# Altium schematic sheet LGT8F328P_48PIN最小系统.SchDoc
size A3
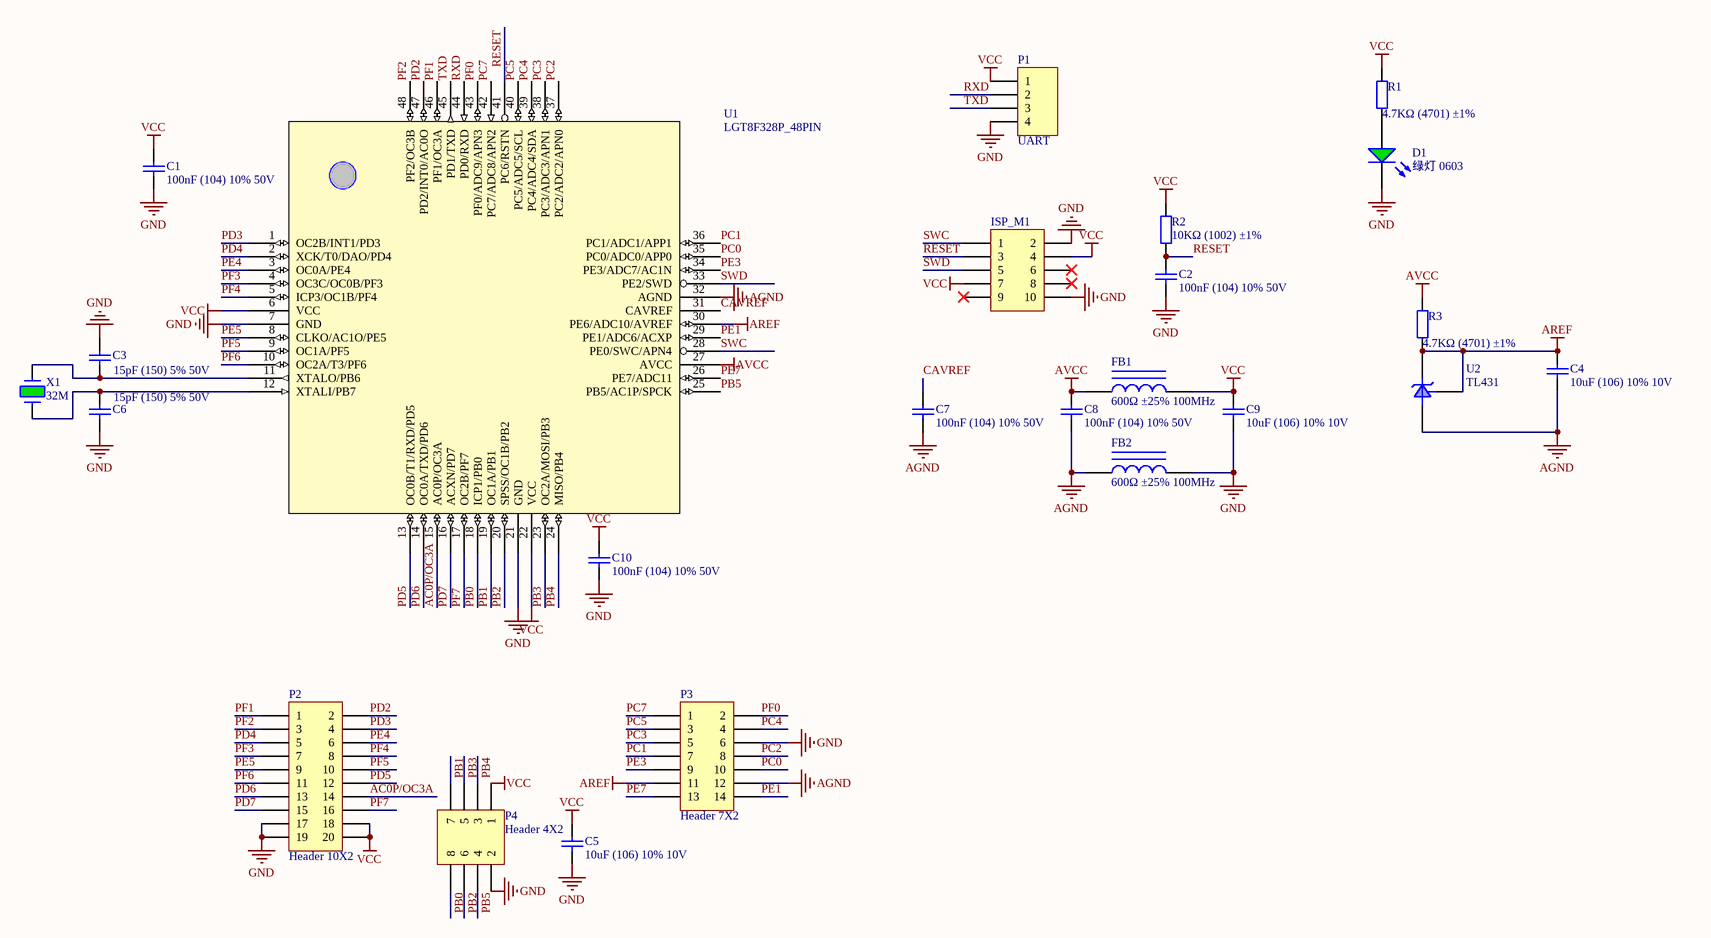
[diagram p0: LGT8F328P_48PIN最小系统.SchDoc]

## Parts
C1  100nF (104) 10% 50V  [LC-0603_C]
C2  100nF (104) 10% 50V  [LC-0603_C]
C3  15pF (150) 5% 50V  [0603_C]
C4  10uF (106) 10% 10V  [LC-0603_C]
C5  10uF (106) 10% 10V  [LC-0603_C]
C6  15pF (150) 5% 50V  [0603_C]
C7  100nF (104) 10% 50V  [LC-0603_C]
C8  100nF (104) 10% 50V  [LC-0603_C]
C9  10uF (106) 10% 10V  [LC-0603_C]
C10  100nF (104) 10% 50V  [LC-0603_C]
D1  绿灯 0603  [0603_LED_S1]
FB1  600Ω ±25% 100MHz  [0805_L]
FB2  600Ω ±25% 100MHz  [0805_L]
ISP_M1  ISP2*5  [IDC2x5]  (value not drawn)
P1  UART  [HDR1X4]
P2  Header 10X2  [HDR2X10]
P3  Header 7X2  [HDR2X7]
P4  Header 4X2  [HDR2X4]
R1  4.7KΩ (4701) ±1%  [LC-0603_R]
R2  10KΩ (1002) ±1%  [LC-0603_R]
R3  4.7KΩ (4701) ±1%  [LC-0603_R]
U1  LGT8F328P_48PIN  [LC-LQFP-48_7x7x05P]
U2  TL431  [LC-SOT-23(SOT-23-3)]
X1  32M  [49/S_N]

## Nets
AGND: C4.1 C7.1 C8.1 FB2.1 P3.12 U1.32(AGND) U2.3(A)
AREF: C4.2 P3.11 R3.1 U1.30(PE6/ADC10/AVREF) U2.1(R) U2.2(K)
AVCC: C8.2 FB1.1 R3.2 U1.27(AVCC)
GND: C1.2 C2.1 C3.2 C5.1 C6.1 C9.1 C10.2 D1.K FB2.2 ISP_M1.2 ISP_M1.10 P1.4 P2.17 P2.19 P3.6 P4.2 U1.7(GND) U1.21(GND)
VCC: C1.1 C5.2 C9.2 C10.1 FB1.2 ISP_M1.4 ISP_M1.7 P1.1 P2.18 P2.20 P4.1 R1.2 R2.2 U1.6(VCC) U1.22(VCC)
AC0P/OC3A: P2.14 U1.15(AC0P/OC3A)
CAVREF: C7.2 U1.31(CAVREF)
PB0: P4.8 U1.18(ICP1/PB0)
PB1: P4.7 U1.19(OC1A/PB1)
PB2: P4.6 U1.20(SPSS/OC1B/PB2)
PB3: P4.5 U1.23(OC2A/MOSI/PB3)
PB4: P4.3 U1.24(MISO/PB4)
PB5: P4.4 U1.25(PB5/AC1P/SPCK)
PC0: P3.10 U1.35(PC0/ADC0/APP0)
PC1: P3.7 U1.36(PC1/ADC1/APP1)
PC2: P3.8 U1.37(PC2/ADC2/APN0)
PC3: P3.5 U1.38(PC3/ADC3/APN1)
PC4: P3.4 U1.39(PC4/ADC4/SDA)
PC5: P3.3 U1.40(PC5/ADC5/SCL)
PC7: P3.1 U1.42(PC7/ADC8/APN2)
PD2: P2.2 U1.47(PD2/INT0/AC0O)
PD3: P2.4 U1.1(OC2B/INT1/PD3)
PD4: P2.5 U1.2(XCK/T0/DAO/PD4)
PD5: P2.12 U1.13(OC0B/T1/RXD/PD5)
PD6: P2.13 U1.14(OC0A/TXD/PD6)
PD7: P2.15 U1.16(ACXN/PD7)
PE1: P3.14 U1.29(PE1/ADC6/ACXP)
PE3: P3.9 U1.34(PE3/ADC7/AC1N)
PE4: P2.6 U1.3(OC0A/PE4)
PE5: P2.9 U1.8(CLKO/AC1O/PE5)
PE7: P3.13 U1.26(PE7/ADC11)
PF0: P3.2 U1.43(PF0/ADC9/APN3)
PF1: P2.1 U1.46(PF1/OC3A)
PF2: P2.3 U1.48(PF2/OC3B)
PF3: P2.7 U1.4(OC3C/OC0B/PF3)
PF4: P2.8 U1.5(ICP3/OC1B/PF4)
PF5: P2.10 U1.9(OC1A/PF5)
PF6: P2.11 U1.10(OC2A/T3/PF6)
PF7: P2.16 U1.17(OC2B/PF7)
RESET: C2.2 ISP_M1.3 R2.1 U1.41(PC6/RSTN)
RXD: P1.2 U1.44(PD0/RXD)
SWC: ISP_M1.1 U1.28(PE0/SWC/APN4)
SWD: ISP_M1.5 U1.33(PE2/SWD)
TXD: P1.3 U1.45(PD1/TXD)
NetC3_1: C3.1 U1.11(XTALO/PB6) X1.1
NetC6_2: C6.2 U1.12(XTALI/PB7) X1.2
NetD1_A: D1.A R1.1

Not connected (* = marked no-connect by the designer): ISP_M1 6* 8* 9*

## Library data of the parts
C1 C2 C7 C8 C10 = 0603 100nF (104) 10% 50V: 贴片电容; ComponentLink1Description: 供应商链接; ComponentLink1URL: http://www.szlcsc.com/product/details_15331.html; Package: 0603; Supplier: LC; SuppliersPartNumber: C14663
C3 C6 = 0603 15pF (150) 5% 50V: 贴片电容; ComponentLink1Description: 供应商链接; ComponentLink1URL: http://www.szlcsc.com/product/details_1996.html; Package: 0603; Supplier: LC; SuppliersPartNumber: C1644
C4 C5 C9 = 0603 10uF (106) 10% 10V: 贴片电容; ComponentLink1Description: 供应商链接; ComponentLink1URL: http://www.szlcsc.com/product/details_20411.html; Package: 0603; Supplier: LC; SuppliersPartNumber: C19702
D1 = 0603 绿灯: 发光二极管; ComponentLink1Description: 供应商链接; ComponentLink1URL: http://www.szlcsc.com/product/details_73152.html; Package: 0603; Supplier: LC; SuppliersPartNumber: C72043
FB1 FB2 = 0805 600Ω 25% 100MHz: 贴片磁珠; ComponentLink1Description: 供应商链接; ComponentLink1URL: http://www.szlcsc.com/product/details_1369.html; Package: 0805; Supplier: LC; SuppliersPartNumber: C1017
ISP_M1 = ISP2*5: Header, 5-Pin, Dual row; LatestRevisionDate: 17-Jul-2002; LatestRevisionNote: Re-released for DXP Platform.; Publisher: Altium Limited
P1 = Header 4: Header, 4-Pin; LatestRevisionDate: 17-Jul-2002; LatestRevisionNote: Re-released for DXP Platform.; Publisher: Altium Limited
P2 = Header 10X2: Header, 10-Pin, Dual row; LatestRevisionDate: 17-Jul-2002; LatestRevisionNote: Re-released for DXP Platform.; Publisher: Altium Limited
P3 = Header 7X2: Header, 7-Pin, Dual row; LatestRevisionDate: 17-Jul-2002; LatestRevisionNote: Re-released for DXP Platform.; Publisher: Altium Limited
P4 = Header 4X2: Header, 4-Pin, Dual row; LatestRevisionDate: 17-Jul-2002; LatestRevisionNote: Re-released for DXP Platform.; Publisher: Altium Limited
R1 R3 = 0603 4.7KΩ (4701) 1%: 贴片电阻; ComponentLink1Description: 供应商链接; ComponentLink1URL: http://www.szlcsc.com/product/details_23889.html; Package: 0603; Supplier: LC; SuppliersPartNumber: C23162
R2 = 0603 10KΩ (1002) 1%: 贴片电阻; ComponentLink1Description: 供应商链接; ComponentLink1URL: http://www.szlcsc.com/product/details_26547.html; Package: 0603; Supplier: LC; SuppliersPartNumber: C25804
U2 = CJ431 0.5%431: 电压基准; ComponentLink1Description: 供应商链接; ComponentLink1URL: http://www.szlcsc.com/product/details_3500.html; Package: SOT-23; Supplier: LC; SuppliersPartNumber: C3113
X1 = CRYSTAL